# EAGLE design Amis-esp8266d (EAGLE 9.5.2)
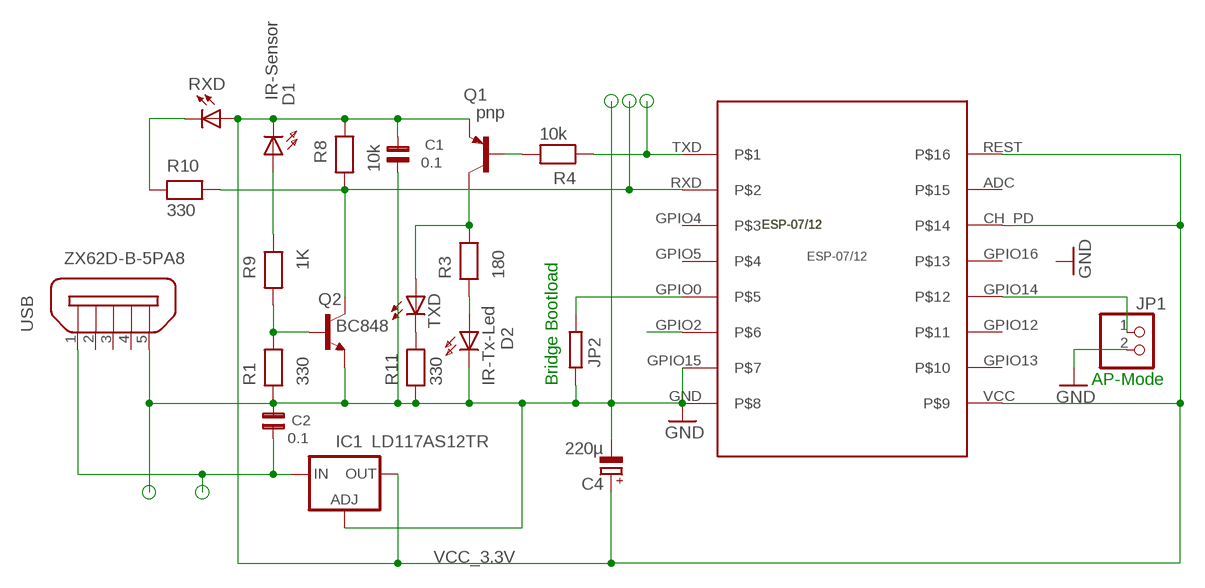
[diagram p0: schematic, sheet 1]

## Parts
C1  0.1  C0805W  [0805W]
C2  0.1  C0805W  [0805W]
C4  220µ  CPOL-EU153CLV-0605  [153CLV-0605]
D1  IR-Sensor  HSMXC670  [HSMXC670]
D2  IR-Tx-Led  HSMXC670  [HSMXC670]
IC1  LD117AS12TR  [SOT223]
JP1  PINHD-1X2  [1X02]
JP2  R-EU_R1210W  [R1210W]
Q1  pnp  MMBTA56-SOT23  [SOT23]
Q2  BC848  [SOT23]
R1  330  R0805W  [0805W]
R3  180  R0805W  [0805W]
R4  10k  R0805W  [0805W]
R8  10k  R0805W  [0805W]
R9  1K  R0805W  [0805W]
R10  330  R0805W  [0805W]
R11  330  R0805W  [0805W]
RXD  LEDSML0805  [SML0805]
TXD  LEDSML0805  [SML0805]
U$2  ESP-07/12  [ESP-07/12]
USB  ZX62D-B-5PA8  [ZX62D-B-5PA8]

## Nets
DC1: C2.1 IC1.3(IN) USB.1
GND: C1.1 C2.2 C4.- D2.K(C) IC1.1(ADJ) JP1.2 JP2.1 Q2.2(E) R1.1 R11.1 U$2.GND U$2.GPIO15 USB.5
N$1: Q1.3(C) R3.2 TXD.A
N$2: Q1.1(B) R4.2
N$3: D2.A R3.1
N$4: D1.A R9.2
N$6: Q2.3(C) R8.1 R10.2 U$2.RXD
N$7: Q2.1(B) R1.2 R9.1
N$8: JP1.1 U$2.GPIO14
N$9: R4.1 U$2.TXD
N$11: JP2.2 U$2.GPIO0
N$12: R10.1 RXD.C
N$13: R11.2 TXD.C
TXD1: U$2.GPIO2
VCC_3.3V: C1.2 C4.+ D1.K(C) IC1.4(OUT) Q1.2(E) R8.2 RXD.A U$2.CH_PD U$2.REST U$2.VCC
Unconnected: U$2.ADC U$2.GPIO4 U$2.GPIO5 U$2.GPIO12 U$2.GPIO13 U$2.GPIO16 USB.2 USB.3 USB.4

## Notes on the sheet
- Bridge Bootload | AP-Mode

## Library data of the parts
C1 C2 = zusatz:C0805W
C4 = rcl:CPOL-EU: POLARIZED CAPACITOR, European symbol
D1 D2 = opto-transmittter-hp:HSMXC670: OPTO TRANSMITTER; OC_FARNELL: unknown; OC_NEWARK: unknown
IC1 = v-reg:LD117A?*: Low drop fixed and adjustable positive voltage regulators 1 A Source: http://www.st.com/stonline/products/literature/ds/7194/ld1117axx.pdf
JP1 = pinhead:PINHD-1X2: PIN HEADER
JP2 = rcl:R-EU_: RESISTOR, European symbol
Q1 = transistor-pnp:*-?: PNP Transistor
Q2 = transistor:BC848: NPN TRANSISTOR
R1 R3 R4 R8-R11 = zusatz:R0805W
RXD TXD = led:LED: LED OSRAM: - CHIPLED LG R971, LG N971, LY N971, LG Q971, LY Q971, LO R971, LY R971 LH N974, LH R974 LS Q976, LO Q976, LY Q976 LO Q996 - Hyper CHIPLED LW Q18S LB Q993, LB Q99A, LB R99A - SideLED LS A670, LO A670, LY A670, LG A670, LP A670 LB A673, LV A673, LT A673, LW A673 LH A674 LY A675 LS A676, LA A676, LO A676, LY A676, LW A676 LS A679, LY A679, LG A679 - Hyper Micro SIDELED® LS Y876, LA Y876, LO Y876, LY Y876 LT Y87S - SmartLED LW L88C, LW L88S LB L89C, LB L89S, LG L890 LS L89K, LO L89K, LY L89K LS L896, LA L896, LO L896, LY L896 - TOPLED LS T670, LO T670, LY T670, LG T670, LP T670 LSG T670, LSP T670, LSY T670, LOP T670, LYG T670 LG T671, LOG T671, LSG T671 LB T673, LV T673, LT T673, LW T673 LH T674 LS T676, LA T676, LO T676, LY T676, LB T676, LH T676, LSB T676, LW T676 LB T67C, LV T67C, LT T67C, LS T67K, LO T67K, LY T67K, LW E67C LS E67B, LA E67B, LO E67B, LY E67B, LB E67C, LV E67C, LT E67C LW T67C LS T679, LY T679, LG T679 LS T770, LO T770, LY T770, LG T770, LP T770 LB T773, LV T773, LT T773, LW T773 LH T774 LS E675, LA E675, LY E675, LS T675 LS T776, LA T776, LO T776, LY T776, LB T776 LHGB T686 LT T68C, LB T68C - Hyper Mini TOPLED® LB M676 - Mini TOPLED Santana® LG M470 LS M47K, LO M47K, LY M47K Source: http://www.osram.convergy.de LUXEON: - LUMILED® LXK2-PW12-R00, LXK2-PW12-S00, LXK2-PW14-U00, LXK2-PW14-V00 LXK2-PM12-R00, LXK2-PM12-S00, LXK2-PM14-U00 LXK2-PE12-Q00, LXK2-PE12-R00, LXK2-PE12-S00, LXK2-PE14-T00, LXK2-PE14-U00 LXK2-PB12-K00, LXK2-PB12-L00, LXK2-PB12-M00, LXK2-PB14-N00, LXK2-PB14-P00, LXK2-PB14-Q00 LXK2-PR12-L00, LXK2-PR12-M00, LXK2-PR14-Q00, LXK2-PR14-R00 LXK2-PD12-Q00, LXK2-PD12-R00, LXK2-PD12-S00 LXK2-PH12-R00, LXK2-PH12-S00 LXK2-PL12-P00, LXK2-PL12-Q00, LXK2-PL12-R00 Source: www.luxeon.com KINGBRIGHT: KA-3528ASYC Source: www.kingbright.com
U$2 = ESP-07_12:ESP-07/12: Version 1.0 of the library for the ESP-07/12 full GPIO dev board module byME Jon jonnyradu@gmail.com
USB = usb_con2:ZX62D-B-5PA8: Micro USB Type B Connector - Standard, Shell Through Hole Source: http://www.hirose.co.jp/cataloge_hp/ed_ZX_20140804.pdf; MF: Hirose; MPN: ZX62D-B-5PA8; OC_FARNELL: 2300438; OC_NEWARK: 69W0712

## Net classes
0 default: clearance 0.205 mm

## Board
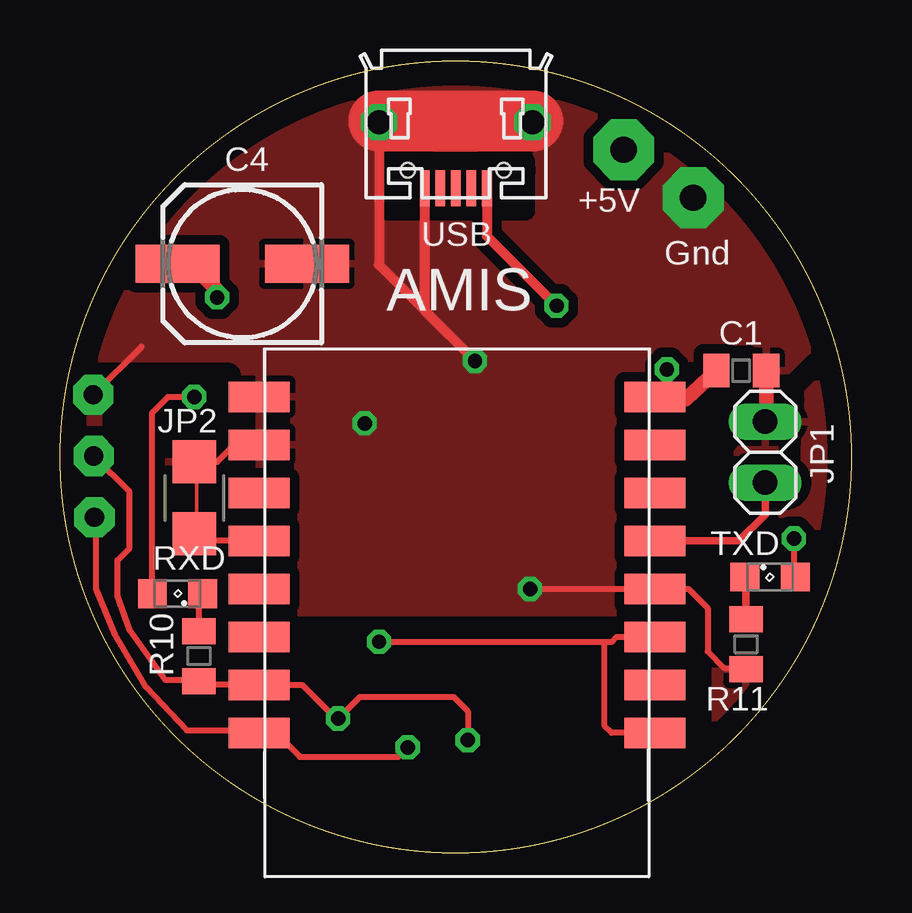
[diagram p1: board, top side]
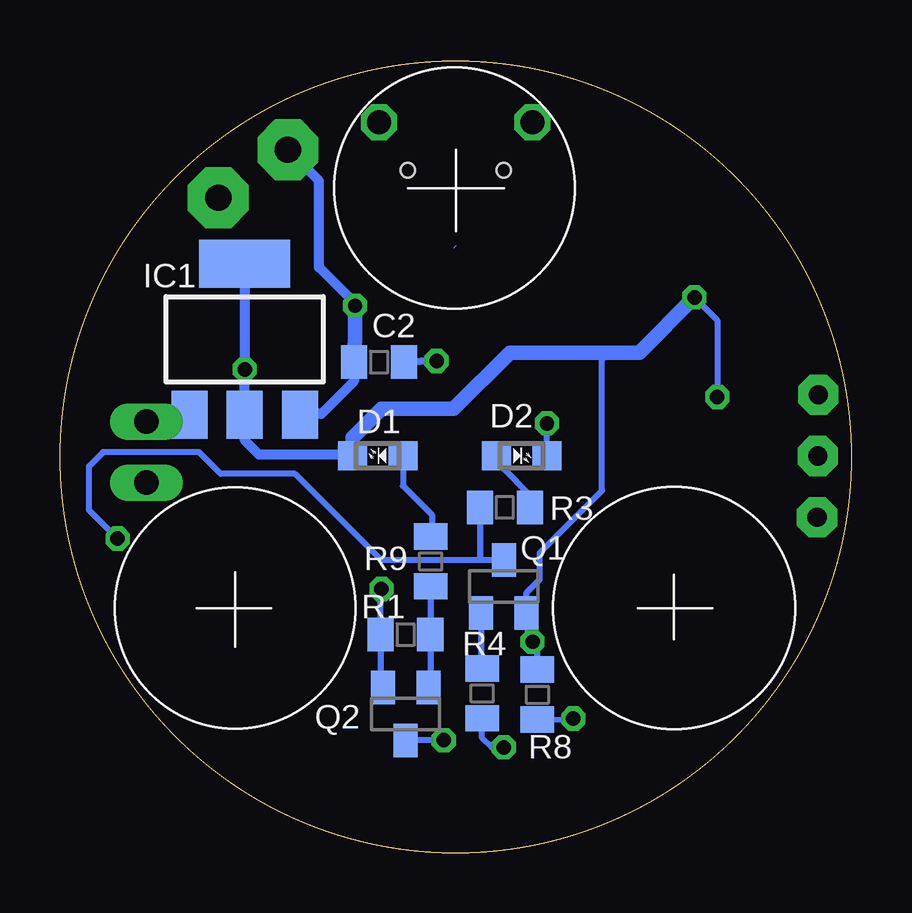
[diagram p2: board, bottom side, seen from below]

Size 33 x 33 mm. Coordinates in mm from the lower left corner, seen from the top.
Outline: circle at 16.5,16.5 radius 16.5
Copper layers (1*16): Top 0.035mm / dielectric 1.5mm / Bottom 0.035mm
Design rules "default *": minimum track width 10mil, minimum drill 24mil, track to track 8mil, track to pad 8mil, pad to pad 8mil, via to via 8mil, smd to smd 8mil, copper to edge 40mil, drill to drill 8mil, minimum pad ring 10mil, minimum via ring 8mil, stop-mask expansion 4mil, vias tented up to drill 0.6mm, thermal gap 10mil
tRestrict: 20 lines
Milling: area 0,0 to 33,33

### Footprints (pad centres in the part's own frame; a part is rotated, then mirrored left to right if it is on the bottom)
0805W = smd 1.092 x 1.397: 1 -1.04,0; 2 1.04,0
153CLV-0605 = smd 3.5 x 1.6: + 2.7,0; - -2.7,0
HSMXC670 = smd 1.2 x 1.2: A -1.05,0; K 1.05,0
SOT223 = smd 1.5 x 2: 1 -2.3,-3.15; 2 0,-3.15; 3 2.3,-3.15 | smd 3.8 x 2: 4 0,3.15
1X02 = drill 1.016 long: 1 -1.27,0; 2 1.27,0
R1210W = smd 1.8 x 1.8: 1 -1.499,0; 2 1.499,0
SOT23 = smd 1 x 1.4: 1 -0.95,-1.1; 2 0.95,-1.1; 3 0,1.1
SML0805 = smd 1.2 x 1.2: A 1.05,0; C -1.05,0
ESP-07/12 = smd 2.54 x 1.27: ADC -0.25,14; CH_PD -0.25,12; GND 16.25,2; GPIO0 16.25,8; GPIO2 16.25,6; GPIO4 16.25,12; GPIO5 16.25,10; GPIO12 -0.25,6; GPIO13 -0.25,4; GPIO14 -0.25,8; GPIO15 16.25,4; GPIO16 -0.25,10; REST -0.25,16; RXD 16.25,14; TXD 16.25,16; VCC -0.25,2
ZX62D-B-5PA8 = smd 1.5 x 0.4: 1 4.6,1.3; 2 4.6,0.65; 3 4.6,0; 4 4.6,-0.65; 5 4.6,-1.3 | drill 1 octagon: P$1 1.85,-3.2; P$2 1.85,3.2 | hole 0.6: 3.85,2; 3.85,-2

### Placement (x,y rotation side)
C1  28.4,20.1 180 top
C2  19.7,20.45 0 bottom
C4  7.6,24.55 180 top
D1  19.75,16.55 180 bottom
D2  13.75,16.55 0 bottom
IC1  25.3,21.4 0 bottom
JP1  29.4,16.7 90 top
JP2  5.6,14.8 270 top
Q1  14.5,11.1 0 bottom
Q2  18.59,5.79 180 bottom
R1  18.6,9.1 0 bottom
R3  14.45,14.4 180 bottom
R4  15.4,6.65 90 bottom
R8  13.1,6.6 90 bottom
R9  17.55,12.15 90 bottom
R10  5.8,8.2 270 top
R11  28.6,8.7 90 top
RXD  4.9,10.8 180 top
TXD  29.6,11.5 0 top
U$2  24.55,21 180 top
USB  16.5,32.3 270 top

### Tracks (layer width: path | path; a pad name or v marks a point on that pad's centre or on a via)
DC1  (via drill 0.6, 1.1 pad 2.54)
  Top 0.406: v20.7,22.8 17.8,25.7 USB.1
  Bottom 0.406: C2.1 20.74,19.66 22.1,18.3 22.95,18.3 IC1.3 | 20.6,22.9 20.7,22.9 22.2,24.4 22.2,28 v23.5,29.3
  Bottom 0.61: C2.1 20.7,21.51 v20.7,22.8 20.6,22.9
GND  (via drill 0.6, 0.8 pad 1.68, 1.1 pad 2.54)
  Top 0.254: R11.1 28.56,7.7 27.7,7.7 27,8.4 27,10.2 26.2,11 v19.6,11 | JP2.1 6.56,16.3 7.4,17.15 | v1.39,19.09 3.4,21.1
  Top 0.305: 7.4,17.15 U$2.GPIO15 | 7.4,18.85 U$2.GND
  Top 0.406: USB.5 15.2,22.6 v17.3,20.5 13.3,24.5 13.3,30.5
  Top 0.61: C1.1 29.44,18.01 JP1.2
  Top 2.54: 13.3,30.5 19.7,30.5
  Bottom 0.254: Q2.2 19.64,6.99 R1.1 19.64,10.96 v19.6,11 | D2.K v12.7,17.9
  Bottom 0.305: v17.3,20.5 17.61,20.5 C2.2
  Bottom 0.406: IC1.1 29.12,18.25 JP1.2
  other vias: 26.4,27.3
  pour Top (isolate 0.406): 0,33 33.1,33 33,0 -0.1,0
N$1  (via drill 0.6)
  Top 0.254: v30.6,13.1 30.6,11.55 TXD.A
  Bottom 0.254: Q1.3 15.6,12.2 | 15.6,12.2 19.6,12.2 23.2,15.8 26.3,15.8 27.2,16.7 31.2,16.7 31.8,16.1 31.8,14.3 v30.6,13.1 | R3.2 15.49,12.31 15.6,12.2
N$2
  Bottom 0.254: Q1.1 15.45,7.74 R4.2
N$3
  Bottom 0.254: R3.1 13.41,14.91 14.5,16 14.5,16.25 D2.A
N$4
  Bottom 0.254: D1.A 18.7,15.3 17.5,14.1 17.5,13.24 R9.2
N$5
  Top 0.15: 5.7,16.2 5.7,13.5
N$6  (via drill 0.6, 0.8 pad 1.68)
  Top 0.254: 11.5,5.6 10.1,7 U$2.RXD 6.19,7 arc-45 R10.2 5.8,7.2 4.4,7.2 2.9,9.3 2.4,10.7 2.4,12.2 2.9,12.7 2.9,12.8 2.9,15.05 v1.41,16.54 | 11.5,5.6 v11.6,5.6 | v11.6,5.6 12.5,6.5 16.4,6.5 17,5.9 v17,4.7 | v11.6,5.6 11.6,5.5 11.5,5.6
  Bottom 0.254: v17,4.7 Q2.3 | R8.1 12.46,5.56 v11.6,5.6
N$7
  Bottom 0.254: Q2.1 17.56,6.97 R1.2 R9.1
N$8
  Top 0.305: U$2.GPIO14 28.3,13 29.4,14.1 JP1.1
N$9  (via drill 0.6, 0.8 pad 1.68)
  Top 0.254: v14.5,4.4 14.1,4 10,4 9,5 U$2.TXD arc90 8.2,5.1 5.3,5.1 3.6,6.9 2.3,9.1 1.5,11 1.5,13 1.5,13.92 v1.44,13.98
  Bottom 0.254: v14.5,4.4 15,4.4 15.4,4.8 R4.1
N$11
  Top 0.254: U$2.GPIO0 5.9,13 JP2.2
N$12
  Top 0.254: R10.1 5.8,10.65 RXD.C
N$13
  Top 0.305: R11.2 28.6,11.45 TXD.C
N$15
  Bottom 0: 16.5,25.3 16.6,25.2
VCC_3.3V  (via drill 0.6)
  Top 0.254: U$2.REST 23,5 22.7,5.3 22.7,8.8 | v13.3,8.8 22.7,8.8 | 22.7,8.8 23,8.8 23.2,9 U$2.CH_PD | RXD.A 3.85,18.35 4.5,19 v5.6,19
  Top 0.406: v25.3,20.15 25.3,18.9 | U$2.VCC 25.5,19 25.6,18.9
  Top 0.61: 4.95,24.5 C4.+ 5.35,24.1 5.9,24.1 6.55,23.45 v6.55,23.15 | 25,18.9 25.3,18.9 25.6,18.9 26.1,18.9 C1.2 27.4,20.14
  Bottom 0.254: R8.2 13.1,8.6 v13.3,8.8 13.5,9 13.5,9.95 Q1.2 13.55,10.85 13,11.4 13,12.5 10.4,15.1 10.4,20.55 10.1,20.85 | v5.6,19 5.6,22.2 v6.55,23.15
  Bottom 0.305: 12.5,20.8 12.55,20.85
  Bottom 0.406: IC1.4 v25.3,20.15 25.3,17.2 24.7,16.6 20.8,16.6 D1.K
  Bottom 0.61: v6.55,23.15 8.85,20.85 10.1,20.85 12.55,20.85 14.25,20.85 16.6,18.5 19.6,18.5 20.8,17.3 20.8,16.6

### Text on the board
tPlace: +5V | Gnd
tNames: AMIS